# Altium schematic sheet 电机驱动.SchDoc
size A4
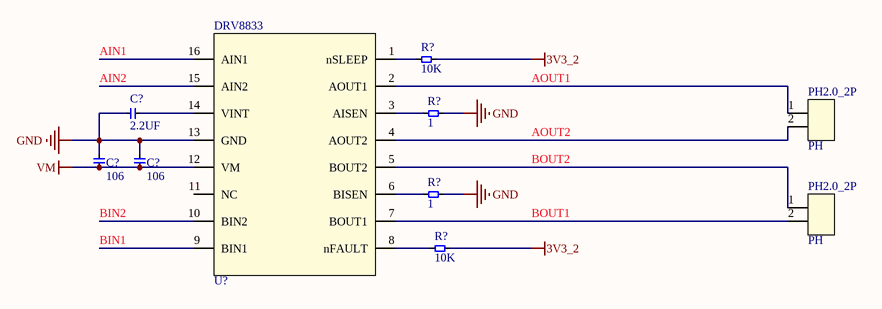
[diagram p0: 电机驱动.SchDoc]

## Parts
(Parts that share a designator on the sheet are numbered #1, #2 ... from top to bottom, then left to right.)
C?#1  2.2UF  [C_0402]
C?#2  106  [C_0402]
C?#3  106  [C_0402]
DRV8833  U?  [QFN16]
PH2.0_2P#1  PH  [PH2.0-LS-2P]
PH2.0_2P#2  PH  [PH2.0-LS-2P]
R?#1  10K  [R_0603]
R?#2  1  [R_1206]
R?#3  1  [R_1206]
R?#4  10K  [R_0603]

## Nets
3V3_2: R?#1.2 R?#4.2
GND: C?#1.2 C?#2.2 C?#3.2 DRV8833.13(GND) R?#2.2 R?#3.2
VM: C?#2.1 C?#3.1 DRV8833.12(VM)
AIN1: DRV8833.16(AIN1)
AIN2: DRV8833.15(AIN2)
AOUT1: DRV8833.2(AOUT1) PH2.0_2P#1.1
AOUT2: DRV8833.4(AOUT2) PH2.0_2P#1.2
BIN1: DRV8833.9(BIN1)
BIN2: DRV8833.10(BIN2)
BOUT1: DRV8833.7(BOUT1) PH2.0_2P#2.2
BOUT2: DRV8833.5(BOUT2) PH2.0_2P#2.1
NetC?#1_1: C?#1.1 DRV8833.14(VINT)
NetDRV8833_1: DRV8833.1(nSLEEP) R?#1.1
NetDRV8833_3: DRV8833.3(AISEN) R?#2.1
NetDRV8833_6: DRV8833.6(BISEN) R?#3.1
NetDRV8833_8: DRV8833.8(nFAULT) R?#4.1

Not connected (* = marked no-connect by the designer): DRV8833 11(NC)

## Library data of the parts
C?#1-C?#3 = C_无极贴片: 无极性贴片电容
DRV8833 = DRV8833
PH2.0_2P#1 PH2.0_2P#2 = PH2.0_2P
R?#1-R?#4 = R_贴片: 贴片电阻